# Altium schematic sheet PD Regulator.SchDoc
size B; SheetNumber: 7; SheetTotal: 8
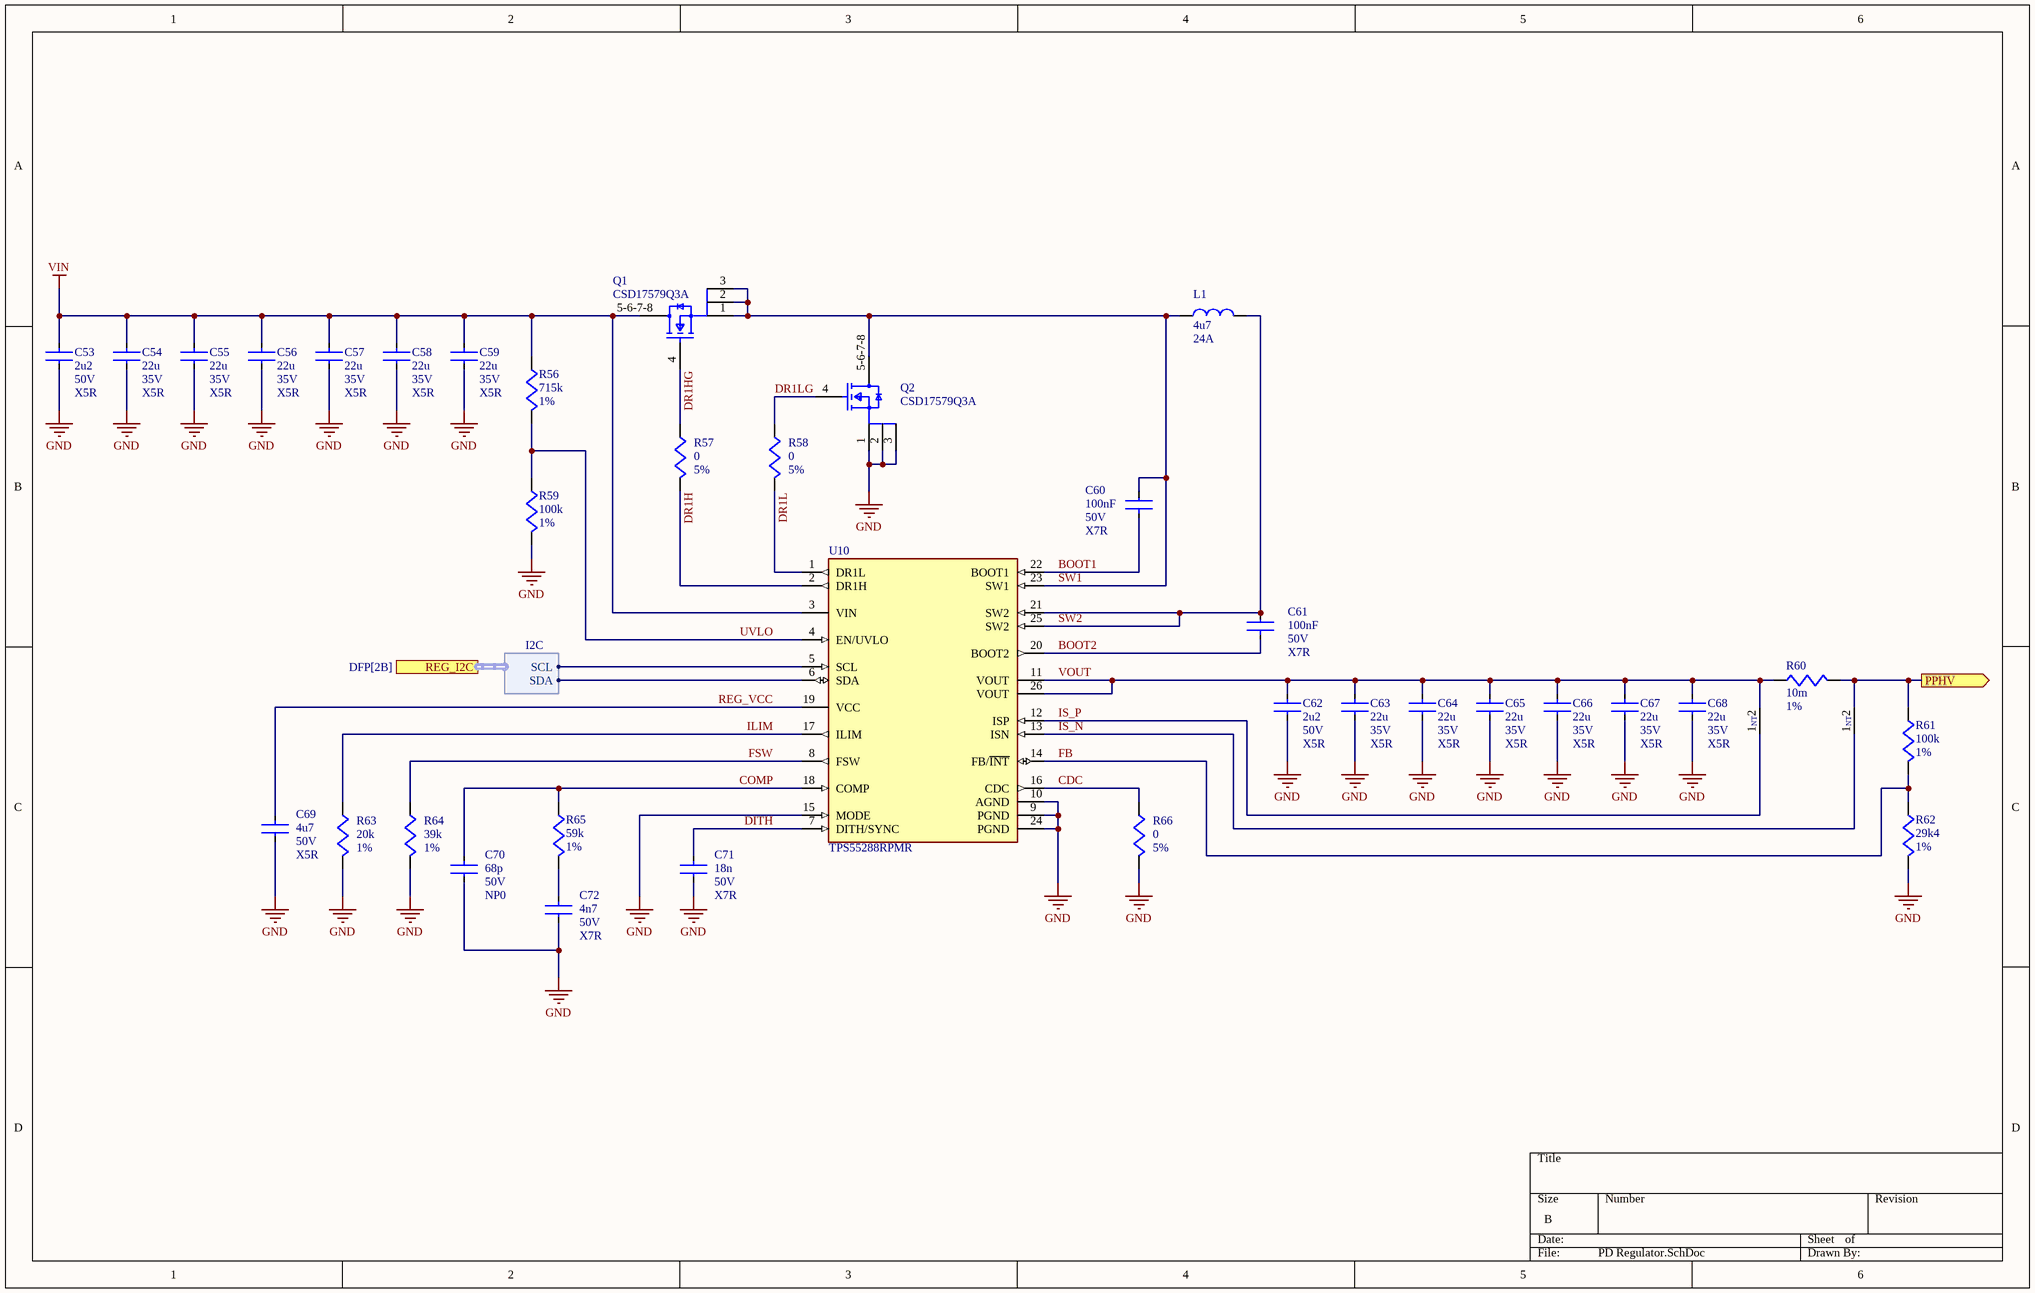
[diagram p0: PD Regulator.SchDoc]

## Parts
C53  value 2u2  Voltage: 50V  Dielectric: X5R  [CAPC2012X14N]  (hidden comment: 2.2uF 50V 0805)
C54  value 22u  Voltage: 35V  Dielectric: X5R  [CAPC3225X18N]  (hidden comment: 22uF 35V 1210 X5R)
C55  value 22u  Voltage: 35V  Dielectric: X5R  [CAPC3225X18N]  (hidden comment: 22uF 35V 1210 X5R)
C56  value 22u  Voltage: 35V  Dielectric: X5R  [CAPC3225X18N]  (hidden comment: 22uF 35V 1210 X5R)
C57  value 22u  Voltage: 35V  Dielectric: X5R  [CAPC3225X18N]  (hidden comment: 22uF 35V 1210 X5R)
C58  value 22u  Voltage: 35V  Dielectric: X5R  [CAPC3225X18N]  (hidden comment: 22uF 35V 1210 X5R)
C59  value 22u  Voltage: 35V  Dielectric: X5R  [CAPC3225X18N]  (hidden comment: 22uF 35V 1210 X5R)
C60  value 100nF  Voltage: 50V  Dielectric: X7R  [CAPC1608X08N]  (hidden comment: 100nF 50V X7R 0603)
C61  value 100nF  Voltage: 50V  Dielectric: X7R  [CAPC1608X08N]  (hidden comment: 100nF 50V X7R 0603)
C62  value 2u2  Voltage: 50V  Dielectric: X5R  [CAPC2012X14N]  (hidden comment: 2.2uF 50V 0805)
C63  value 22u  Voltage: 35V  Dielectric: X5R  [CAPC3225X18N]  (hidden comment: 22uF 35V 1210 X5R)
C64  value 22u  Voltage: 35V  Dielectric: X5R  [CAPC3225X18N]  (hidden comment: 22uF 35V 1210 X5R)
C65  value 22u  Voltage: 35V  Dielectric: X5R  [CAPC3225X18N]  (hidden comment: 22uF 35V 1210 X5R)
C66  value 22u  Voltage: 35V  Dielectric: X5R  [CAPC3225X18N]  (hidden comment: 22uF 35V 1210 X5R)
C67  value 22u  Voltage: 35V  Dielectric: X5R  [CAPC3225X18N]  (hidden comment: 22uF 35V 1210 X5R)
C68  value 22u  Voltage: 35V  Dielectric: X5R  [CAPC3225X18N]  (hidden comment: 22uF 35V 1210 X5R)
C69  value 4u7  Voltage: 50V  Dielectric: X5R  [CAPC2012X14N]  (hidden comment: 4.7uF 50V 0805)
C70  value 68p  Voltage: 50V  Dielectric: NP0  [CAPC1005X06N]  (hidden comment: 68pF 50V 0402)
C71  value 18n  Voltage: 50V  Dielectric: X7R  [CAPC1005X06N]  (hidden comment: 18nF 50V 0402)
C72  value 4n7  Voltage: 50V  Dielectric: X7R  [CAPC1005X06N]  (hidden comment: 4.7nF 50V X7R 0402)
L1  value 4u7  Saturation Current: 24A  [INDP134126X58N]  (hidden comment: 4.7uH 24A 20%)
NT1  8mil Net Tie  [Net Tie SMD-Footprint-1]  (value not drawn)  (net tie, no BOM)
NT2  8mil Net Tie  [Net Tie SMD-Footprint-1]  (value not drawn)  (net tie, no BOM)
Q1  CSD17579Q3A  [FP-DNH0008A-MFG]
Q2  CSD17579Q3A  [FP-DNH0008A-MFG]
R56  value 715k  Tolerance: 1%  [RESC1005X04M]  (hidden comment: 715k 1% 0402)
R57  value 0  Tolerance: 5%  [RESC1005X04M]  (hidden comment: 0 Ohm 1% 0402)
R58  value 0  Tolerance: 5%  [RESC1005X04M]  (hidden comment: 0 Ohm 1% 0402)
R59  value 100k  Tolerance: 1%  [RESC1005X04M]  (hidden comment: 100k 1% 0402)
R60  value 10m  Tolerance: 1%  [R1206]  (hidden comment: 10m 1W 1% 1206)
R61  value 100k  Tolerance: 1%  [RESC1005X04M]  (hidden comment: 100k 1% 0402)
R62  value 29k4  Tolerance: 1%  [RESC1005X04M]  (hidden comment: 29k4 1% 0402)
R63  value 20k  Tolerance: 1%  [RESC1005X04M]  (hidden comment: 20k 0402 1%)
R64  value 39k  Tolerance: 1%  [RESC1005X04M]  (hidden comment: 39k 1% 0402)
R65  value 59k  Tolerance: 1%  [RESC1005X04M]  (hidden comment: 59k 1% 0402)
R66  value 0  Tolerance: 5%  [RESC1005X04M]  (hidden comment: 0 Ohm 1% 0402)
U10  TPS55288RPMR  [FP-RPM0026A-MFG]

## Ports
PPHV (out, see DFP[2B], PD Controller[2B]), REG_I2C (harness I2C, see DFP[2B])

## Harnesses
I2C: SCL, SDA

## Nets
GND: C53.2 C54.2 C55.2 C56.2 C57.2 C58.2 C59.2 C62.2 C63.2 C64.2 C65.2 C66.2 C67.2 C68.2 C69.2 C70.2 C71.2 C72.2 Q2.1(S) Q2.2(S) Q2.3(S) R59.2 R62.2 R63.2 R64.2 R66.2 U10.9(PGND) U10.10(AGND) U10.15(MODE) U10.24(PGND)
VIN: C53.1 C54.1 C55.1 C56.1 C57.1 C58.1 C59.1 Q1.5-6-7-8(D) R56.1 U10.3(VIN)
BOOT1: C60.1 U10.22(BOOT1)
BOOT2: C61.1 U10.20(BOOT2)
CDC: R66.1 U10.16(CDC)
COMP: C70.1 R65.1 U10.18(COMP)
DITH: C71.1 U10.7(DITH/SYNC)
DR1H: R57.2 U10.2(DR1H)
DR1HG: Q1.4(G) R57.1
DR1L: R58.2 U10.1(DR1L)
DR1LG: Q2.4(G) R58.1
FB: R61.2 R62.1 U10.14(FB/~{INT})
FSW: R64.1 U10.8(FSW)
ILIM: R63.1 U10.17(ILIM)
IS_N: NT1.1 U10.13(ISN)
IS_P: NT2.1 U10.12(ISP)
PPHV: NT1.2 R60.2 R61.1 ; port PPHV
REG_VCC: C69.1 U10.19(VCC)
SW1: C60.2 L1.1 Q1.1(S) Q1.2(S) Q1.3(S) Q2.5-6-7-8(D) U10.23(SW1)
SW2: C61.2 L1.2 U10.21(SW2) U10.25(SW2)
UVLO: R56.2 R59.1 U10.4(EN/UVLO)
VOUT: C62.1 C63.1 C64.1 C65.1 C66.1 C67.1 C68.1 NT2.2 R60.1 U10.11(VOUT) U10.26(VOUT)
NetC72_1: C72.1 R65.2
NetU10_5: U10.5(SCL) ; port REG_I2C.SCL
NetU10_6: U10.6(SDA) ; port REG_I2C.SDA

## Notes on the sheet
- (in symbol CMP-001-0002-2) NT

## Library data of the parts
C53 C62 = CMP-001-00094-1: 50V 2.2uF X5R ±10% 0805 Multilayer Ceramic Capacitors MLCC - SMD/SMT ROHS; LCSC Part #: C377773; Package: 0805
C54-C59 C63-C68 = CMP-001-00092-1: 35V 22uF X5R ±20% 1210 Multilayer Ceramic Capacitors MLCC - SMD/SMT ROHS; LCSC Part #: C778721; Package: 1210
C60 C61 = CMP-001-00093-1: 50V 100nF X7R ±10% 0603 Multilayer Ceramic Capacitors MLCC - SMD/SMT ROHS; LCSC Part #: C1591; Package: 0603
C69 = CMP-001-00089-1: 50V 4.7uF X5R ±10% 0805 Multilayer Ceramic Capacitors MLCC - SMD/SMT ROHS; LCSC Part #: C98192; Package: 0805
C70 = CMP-001-00113-1: 50V 68pF NP0 ±1% 0402 Multilayer Ceramic Capacitors MLCC - SMD/SMT ROHS; Package: 0402; LCSC Part #: C389103
C71 = CMP-001-00111-2: 50V 18nF X7R ±10% 0402 Multilayer Ceramic Capacitors MLCC - SMD/SMT ROHS; LCSC Part #: C576740; Package: 0402
C72 = CMP-001-00114-1: 50V 4.7nF X7R ±10% 0402 Multilayer Ceramic Capacitors MLCC - SMD/SMT ROHS; LCSC Part #: C1538; Package: 0402
L1 = CMP-006-00022-1: 20A 4.7uH Integrated molded inductor ±20% 24A SMD,12.6x13.5mm Power Inductors ROHS; Resistance: 9m; Rated Current: 20A; LCSC Part #: C526021
NT1 NT2 = CMP-001-0002-2: SMD Net Tie 8mil
Q1 Q2 = CMP-013-00041-1: MOSFET N-CH 30V 35A 8VSON; LCSC Part #: C97376
R56 = CMP-009-00228-2: 100mW Thick Film Resistors ±100ppm/℃ ±1% 715kΩ 0402 Chip Resistor - Surface Mount ROHS; LCSC Part #: C2480300; Package: 0402
R57 R58 R66 = CMP-009-00232-1: 62.5mW Thick Film Resistors 50V ±5% 0Ω 0402 Chip Resistor - Surface Mount ROHS; Package: 0402; LCSC Part #: C60485
R59 = CMP-009-00218-1: 62.5mW Thick Film Resistors 50V ±100ppm/℃ ±1% 100kΩ 0402 Chip Resistor - Surface Mount ROHS; LCSC Part #: C60491; Package: 0402
R60 = CMP-009-00229-1: 1W 10mΩ ±70ppm/℃ ±1% 1206 Current Sense Resistors / Shunt Resistors ROHS; LCSC Part #: C105362; Package: 1206
R61 = CMP-009-00218-2: 62.5mW Thick Film Resistors 50V ±100ppm/℃ ±1% 100kΩ 0402 Chip Resistor - Surface Mount ROHS; Package: 0402; LCSC Part #: C60491
R62 = CMP-009-00230-2: 62.5mW Thick Film Resistors 50V ±100ppm/℃ ±1% 29.4kΩ 0402 Chip Resistor - Surface Mount ROHS; LCSC Part #: C26973; Package: 0402
R63 = CMP-009-00185-3: 62.5mW Thick Film Resistors 50V ±100ppm/℃ ±1% 20kΩ 0402 Chip Resistor - Surface Mount ROHS; LCSC Part #: C93942; Package: 0402
R64 = CMP-009-00231-1: 62.5mW Thick Film Resistors 50V ±100ppm/℃ ±1% 39kΩ 0402 Chip Resistor - Surface Mount ROHS; LCSC Part #: C137995; Package: 0402
R65 = CMP-009-00233-1: 62.5mW Thick Film Resistors 50V ±100ppm/℃ ±1% 59kΩ 0402 Chip Resistor - Surface Mount ROHS; LCSC Part #: C163459; Package: 0402
U10 = CMP-019-00063-2: 36V, 16A buck-boost converter with PPS control 26-VQFN-HR -40 to 150; LCSC Part #: C2864583